# EAGLE design led_strip_vert (EAGLE 5.11)
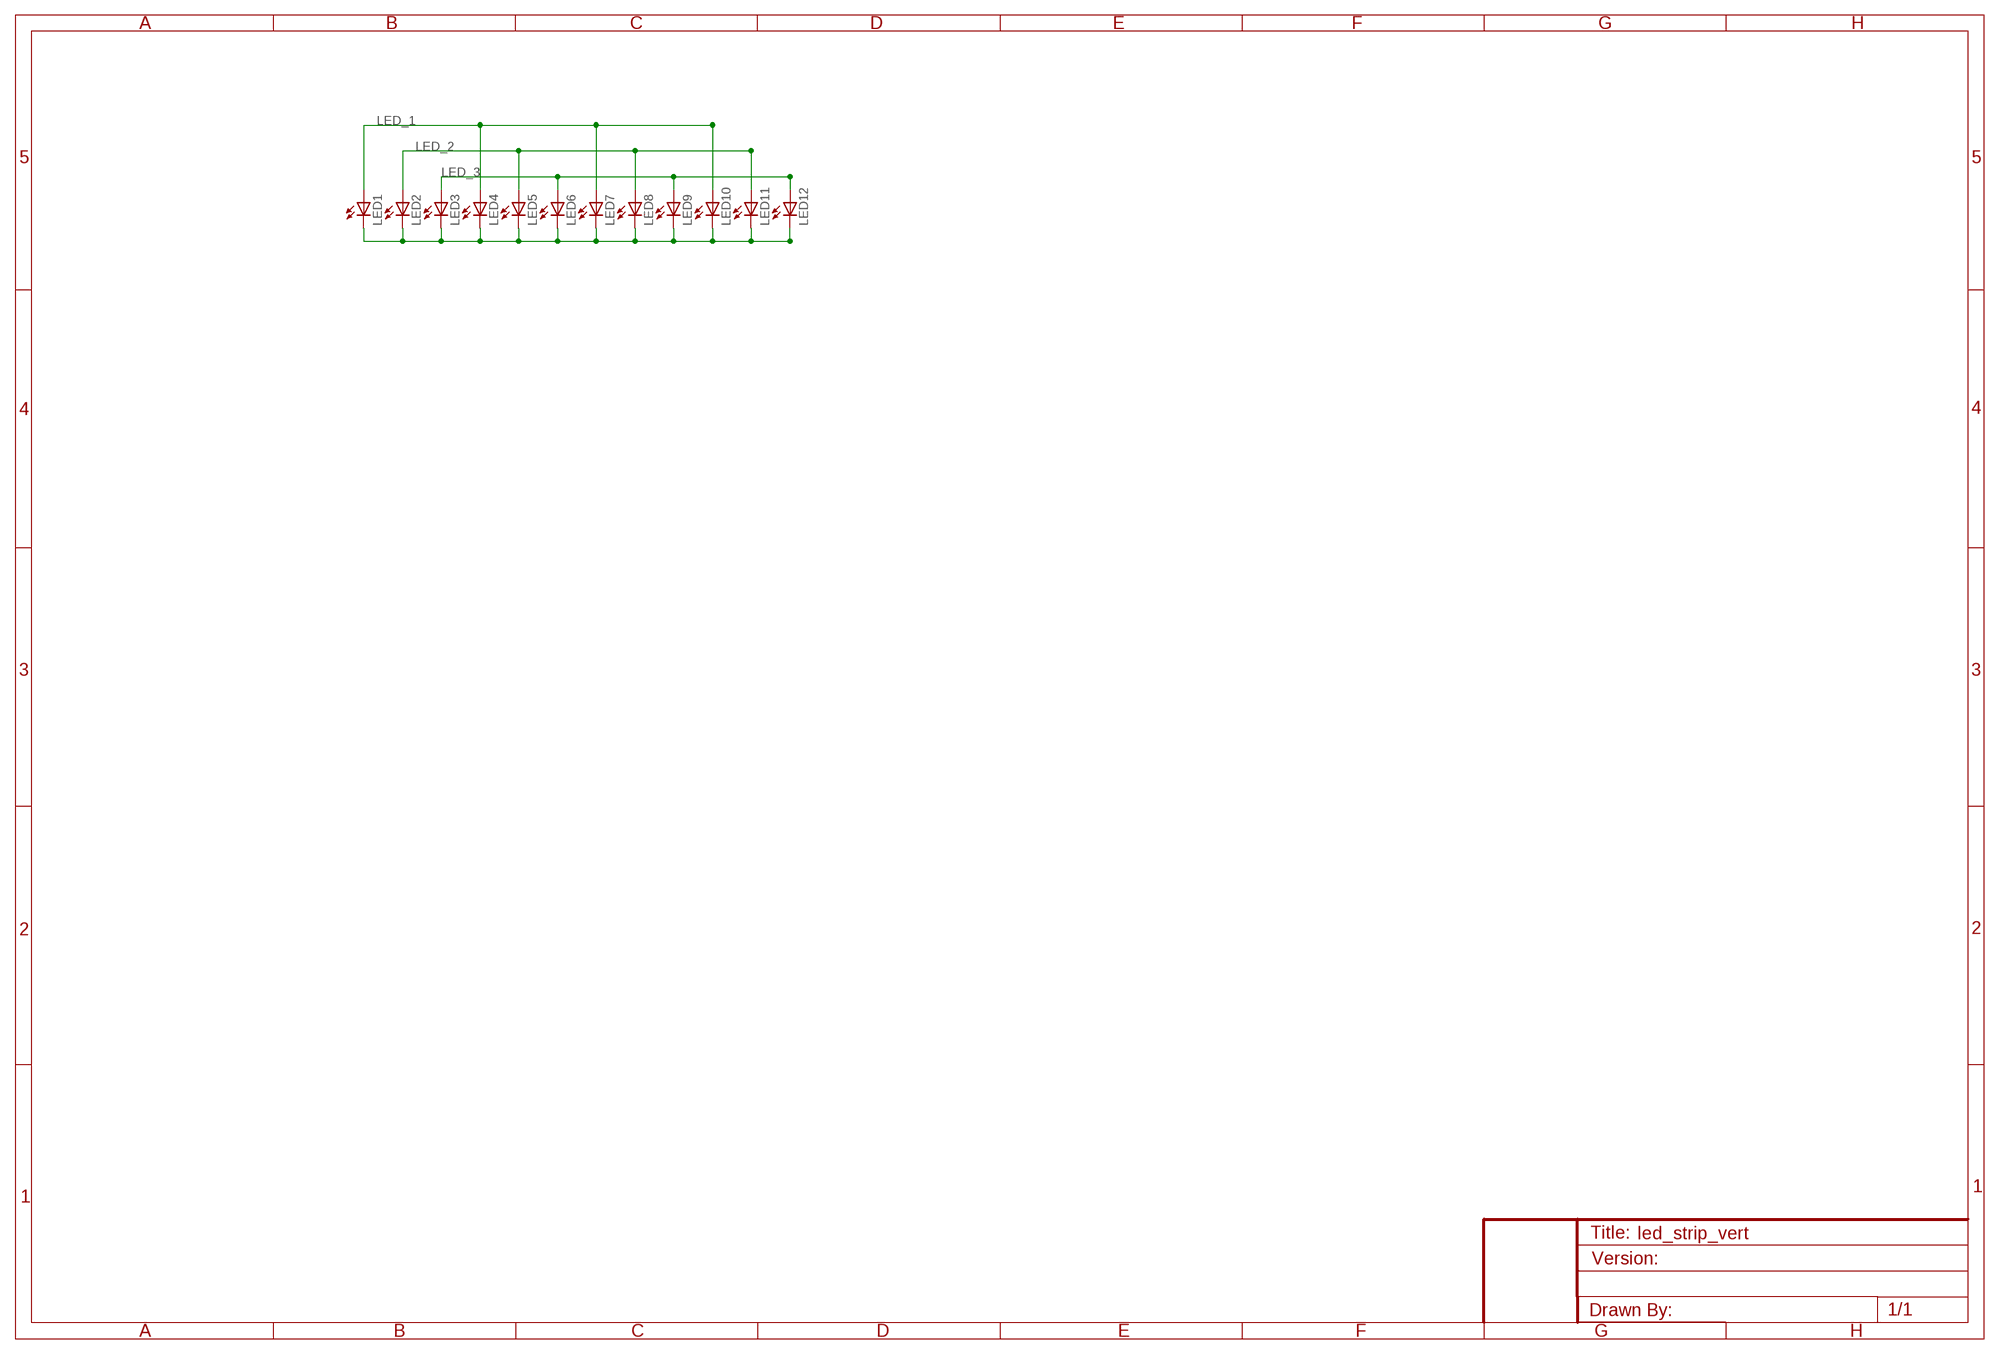
[diagram p0: schematic, sheet 1]

## Parts
LED1  LEDCHIP-LED0805  [CHIP-LED0805]
LED2  LEDCHIP-LED0805  [CHIP-LED0805]
LED3  LEDCHIP-LED0805  [CHIP-LED0805]
LED4  LEDCHIP-LED0805  [CHIP-LED0805]
LED5  LEDCHIP-LED0805  [CHIP-LED0805]
LED6  LEDCHIP-LED0805  [CHIP-LED0805]
LED7  LEDCHIP-LED0805  [CHIP-LED0805]
LED8  LEDCHIP-LED0805  [CHIP-LED0805]
LED9  LEDCHIP-LED0805  [CHIP-LED0805]
LED10  LEDCHIP-LED0805  [CHIP-LED0805]
LED11  LEDCHIP-LED0805  [CHIP-LED0805]
LED12  LEDCHIP-LED0805  [CHIP-LED0805]

## Nets
GND: LED1.C LED2.C LED3.C LED4.C LED5.C LED6.C LED7.C LED8.C LED9.C LED10.C LED11.C LED12.C
LED_1: LED1.A LED4.A LED7.A LED10.A
LED_2: LED2.A LED5.A LED8.A LED11.A
LED_3: LED3.A LED6.A LED9.A LED12.A

## Library data of the parts
LED1-LED12 = led:LED: LED OSRAM: - CHIPLED LG R971, LG N971, LY N971, LG Q971, LY Q971, LO R971, LY R971 LH N974, LH R974 LS Q976, LO Q976, LY Q976 LO Q996 - Hyper CHIPLED LW Q18S LB Q993, LB Q99A, LB R99A - SideLED LS A670, LO A670, LY A670, LG A670, LP A670 LB A673, LV A673, LT A673, LW A673 LH A674 LY A675 LS A676, LA A676, LO A676, LY A676, LW A676 LS A679, LY A679, LG A679 - Hyper Micro SIDELED® LS Y876, LA Y876, LO Y876, LY Y876 LT Y87S - SmartLED LW L88C, LW L88S LB L89C, LB L89S, LG L890 LS L89K, LO L89K, LY L89K LS L896, LA L896, LO L896, LY L896 - TOPLED LS T670, LO T670, LY T670, LG T670, LP T670 LSG T670, LSP T670, LSY T670, LOP T670, LYG T670 LG T671, LOG T671, LSG T671 LB T673, LV T673, LT T673, LW T673 LH T674 LS T676, LA T676, LO T676, LY T676, LB T676, LH T676, LSB T676, LW T676 LB T67C, LV T67C, LT T67C, LS T67K, LO T67K, LY T67K, LW E67C LS E67B, LA E67B, LO E67B, LY E67B, LB E67C, LV E67C, LT E67C LW T67C LS T679, LY T679, LG T679 LS T770, LO T770, LY T770, LG T770, LP T770 LB T773, LV T773, LT T773, LW T773 LH T774 LS E675, LA E675, LY E675, LS T675 LS T776, LA T776, LO T776, LY T776, LB T776 LHGB T686 LT T68C, LB T68C - Hyper Mini TOPLED® LB M676 - Mini TOPLED Santana® LG M470 LS M47K, LO M47K, LY M47K Source: http://www.osram.convergy.de LUXEON: - LUMILED® LXK2-PW12-R00, LXK2-PW12-S00, LXK2-PW14-U00, LXK2-PW14-V00 LXK2-PM12-R00, LXK2-PM12-S00, LXK2-PM14-U00 LXK2-PE12-Q00, LXK2-PE12-R00, LXK2-PE12-S00, LXK2-PE14-T00, LXK2-PE14-U00 LXK2-PB12-K00, LXK2-PB12-L00, LXK2-PB12-M00, LXK2-PB14-N00, LXK2-PB14-P00, LXK2-PB14-Q00 LXK2-PR12-L00, LXK2-PR12-M00, LXK2-PR14-Q00, LXK2-PR14-R00 LXK2-PD12-Q00, LXK2-PD12-R00, LXK2-PD12-S00 LXK2-PH12-R00, LXK2-PH12-S00 LXK2-PL12-P00, LXK2-PL12-Q00, LXK2-PL12-R00 Source: www.luxeon.com KINGBRIGHT: KA-3528ASYC Source: www.kingbright.com

## Board
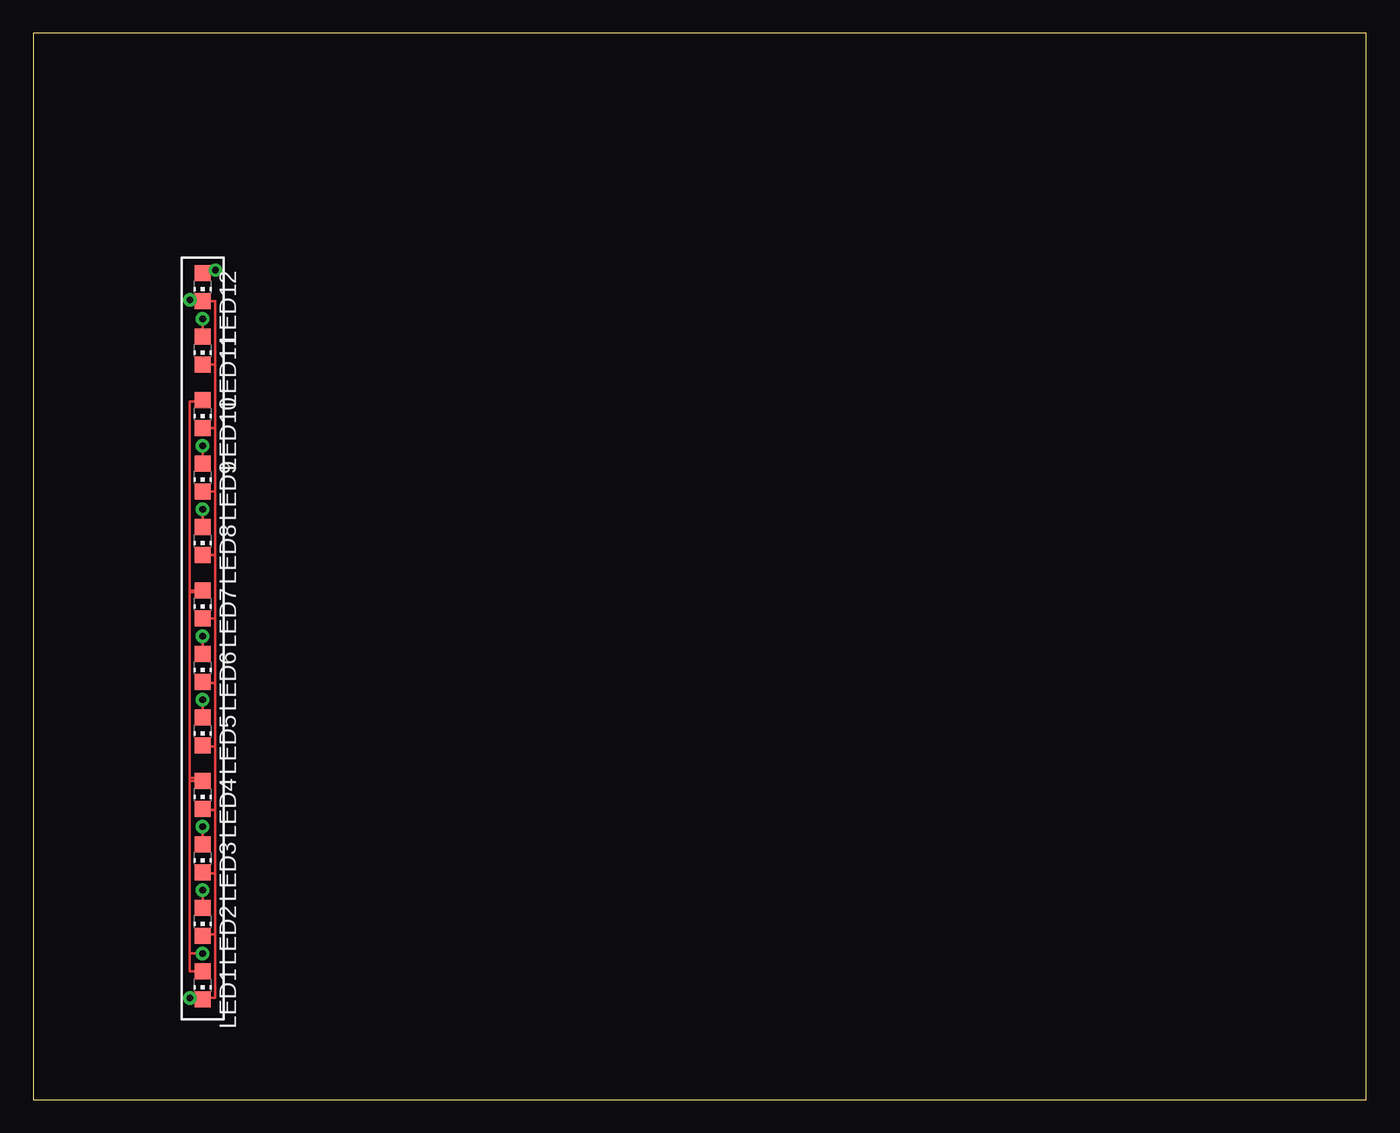
[diagram p1: board, top side]
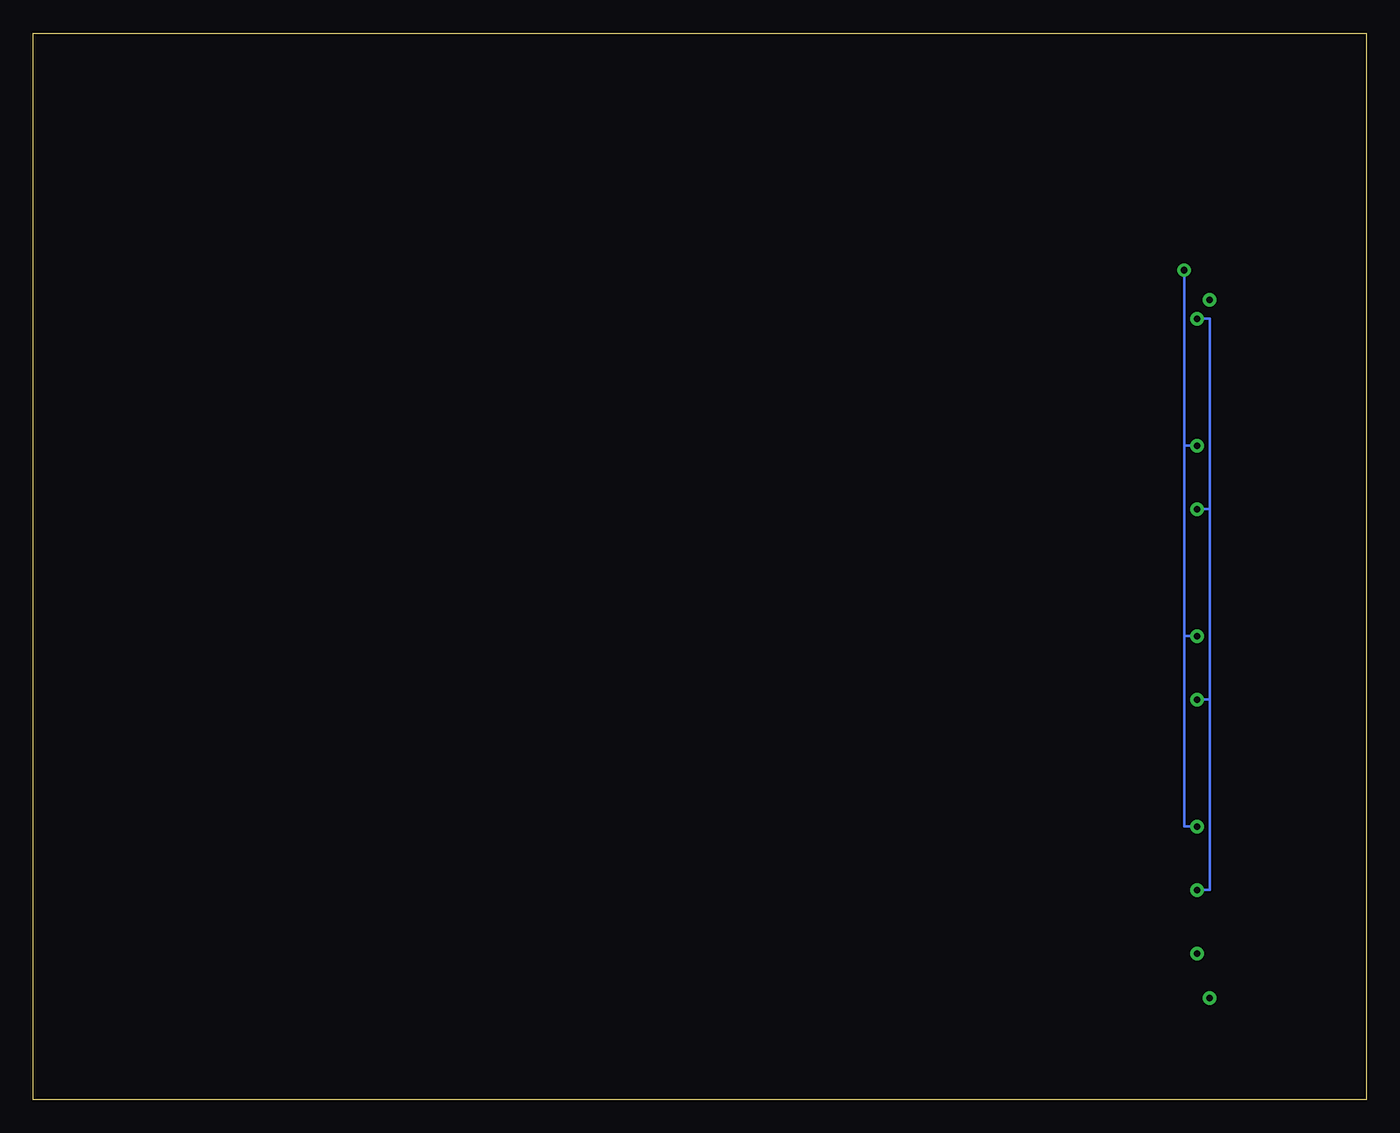
[diagram p2: board, bottom side, seen from below]

Size 100 x 80 mm. Coordinates in mm from the lower left corner, seen from the top.
Outline: 0,0 100,0 100,80 0,80 0,0
Copper layers (1*16): Top 0.035mm / dielectric 1.5mm / Bottom 0.035mm
Design rules "SparkFun_via": minimum track width 8mil, minimum drill 20mil, track to track 8mil, track to pad 8mil, pad to pad 8mil, via to via 8mil, smd to smd 8mil, copper to edge 10mil, drill to drill 8mil, minimum pad ring 12mil, minimum via ring 10mil, stop-mask expansion 4mil, vias tented up to drill 25mil, thermal gap 10mil

### Footprints (pad centres in the part's own frame; a part is rotated, then mirrored left to right if it is on the bottom)
CHIP-LED0805 = smd 1.2 x 1.2: A 0,-1.05; C 0,1.05

### Placement (x,y rotation side)
LED1  12.7,8.57 180 top
LED2  12.7,13.34 180 top
LED3  12.7,18.1 180 top
LED4  12.7,22.86 180 top
LED5  12.7,27.62 180 top
LED6  12.7,32.38 180 top
LED7  12.7,37.15 180 top
LED8  12.7,41.91 180 top
LED9  12.7,46.67 180 top
LED10  12.7,51.44 180 top
LED11  12.7,56.2 180 top
LED12  12.7,60.96 180 top

### Tracks (layer width: path | path; a pad name or v marks a point on that pad's centre or on a via)
GND  (via drill 0.5)
  Top 0.203: LED2.C arc-90 12.8,12.38 13.65,12.38 | LED3.C arc90 12.76,16.99 13.65,16.99 | LED4.C arc90 12.76,21.75 13.65,21.75 | LED5.C arc90 12.76,26.51 13.65,26.51 | LED6.C arc90 12.76,31.27 13.65,31.27 | 13.65,55.15 LED11.C | 13.65,50.38 LED10.C | 13.65,45.62 LED9.C | 13.65,40.86 LED8.C | 13.65,36.1 LED7.C | 13.65,12.38 13.65,16.99 | 13.65,16.99 13.65,21.75 | 13.65,21.75 13.65,26.51 | 13.65,26.51 13.65,31.27 | 13.65,31.27 13.65,36.1 | 13.65,36.1 13.65,40.86 | 13.65,40.86 13.65,45.62 | 13.65,45.62 13.65,50.38 | 13.65,50.38 13.65,55.15 | 13.65,55.15 13.65,59.91 LED12.C 11.75,59.91 v11.75,60.01 | 13.65,12.38 13.65,7.62 12.7,7.62 | 12.7,7.62 v11.75,7.62 | LED1.C 12.7,7.62
LED_1  (via drill 0.5)
  Top 0.203: LED1.A 11.75,9.62 11.75,10.95 | 11.75,24.13 12.7,24.13 LED4.A 11.75,23.91 | 11.75,23.91 11.75,38.1 12.7,38.1 LED7.A 11.75,38.2 11.75,52.39 12.7,52.39 LED10.A | 11.75,10.95 v12.7,10.95 | 11.75,10.95 11.75,23.91
LED_2  (via drill 0.5)
  Top 0.203: LED2.A v12.7,15.72 | v12.7,30 LED5.A | v12.7,58.58 LED11.A | v12.7,44.29 LED8.A
  Bottom 0.203: v12.7,15.72 11.75,15.72 11.75,30 | 11.75,30 v12.7,30 | 11.75,30 11.75,44.29 | 11.75,44.29 v12.7,44.29 | 11.75,44.29 11.75,58.58 v12.7,58.58
LED_3  (via drill 0.5)
  Top 0.203: LED3.A v12.7,20.48 | v12.7,34.77 LED6.A | v12.7,49.05 LED9.A | v13.65,62.23 12.7,62.23 LED12.A
  Bottom 0.203: v12.7,20.48 13.65,20.48 13.65,34.77 | v12.7,34.77 13.65,34.77 | 13.65,34.77 13.65,49.05 | 13.65,49.05 v12.7,49.05 | v12.7,49.05 | v12.7,49.05 13.65,49.05 | 13.65,49.05 | 13.65,49.05 v13.65,62.23